# Altium schematic sheet 2_drivers_e_Motores.SchDoc: Teseu - Drivers
size A4; DocumentNumber: 2; Revision: 0.1; SheetNumber: 3; SheetTotal: 6
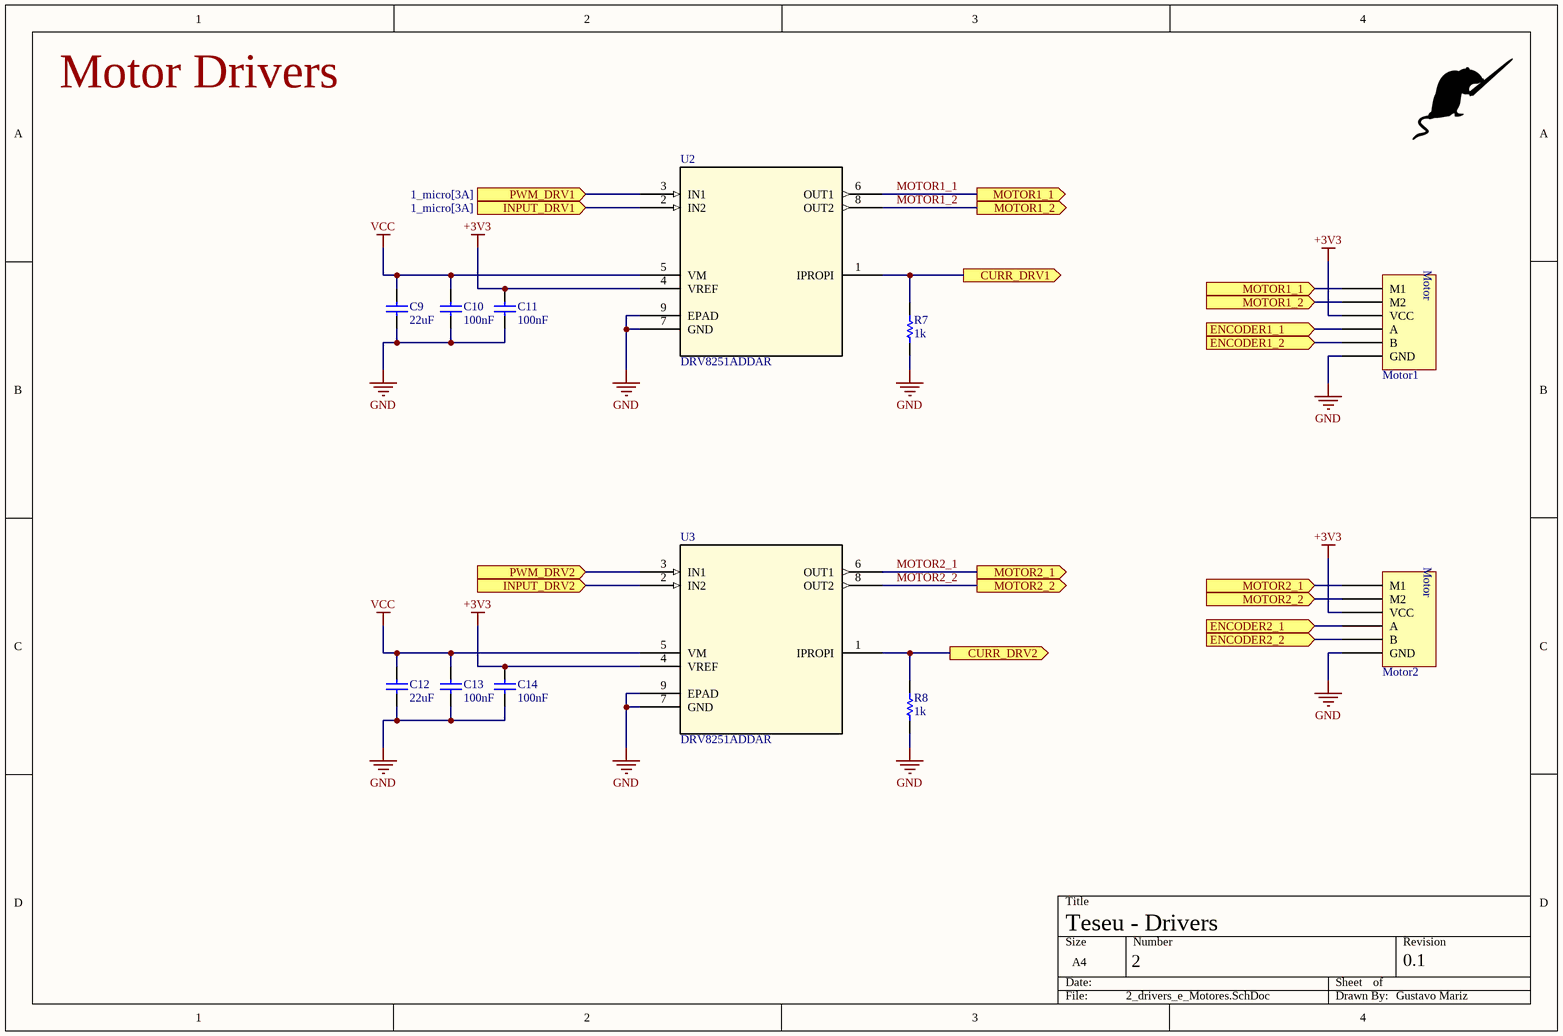
[diagram p0: 2_drivers_e_Motores.SchDoc]

## Parts
C9  Valor: 22uF  [CAP 0805]  (hidden comment: CAP)
C10  Valor: 100nF  [0603]  (hidden comment: CAP)
C11  Valor: 100nF  [0603]  (hidden comment: CAP)
C12  Valor: 22uF  [CAP 0805]  (hidden comment: CAP)
C13  Valor: 100nF  [0603]  (hidden comment: CAP)
C14  Valor: 100nF  [0603]  (hidden comment: CAP)
Motor1  Micro Motor c/ Encoder  [Micro Metal c/ Encoder]  (value not drawn)
Motor2  Micro Motor c/ Encoder  [Micro Metal c/ Encoder]  (value not drawn)
R7  value 1k  [RES 0603]  (hidden comment: RESISTOR)
R8  value 1k  [RES 0603]  (hidden comment: RESISTOR)
U2  DRV8251ADDAR  [SOIC8_DDA_TEX]
U3  DRV8251ADDAR  [SOIC8_DDA_TEX]

## Ports
CURR_DRV1 (out, see 1_micro[2B]), CURR_DRV2 (out, see 1_micro[3A]), ENCODER1_1 (in, see 1_micro[3A]), ENCODER1_2 (in, see 1_micro[2B]), ENCODER2_1 (in, see 1_micro[2A]), ENCODER2_2 (in, see 1_micro[2A]), INPUT_DRV1 (in, see 1_micro[3A]), INPUT_DRV2 (in, see 1_micro[2B]), MOTOR1_1 (in, see 2_drivers_e_Motores[3A]), MOTOR1_1 (out, see 2_drivers_e_Motores[4B]), MOTOR1_2 (in, see 2_drivers_e_Motores[3A]), MOTOR1_2 (out, see 2_drivers_e_Motores[4B]), MOTOR2_1 (in, see 2_drivers_e_Motores[3C]), MOTOR2_1 (out, see 2_drivers_e_Motores[4C]), MOTOR2_2 (in, see 2_drivers_e_Motores[3C]), MOTOR2_2 (out, see 2_drivers_e_Motores[4C]), PWM_DRV1 (in, see 1_micro[3A]), PWM_DRV2 (in, see 1_micro[2B])

## Nets
+3V3: C11.2 C14.2 Motor1.4(VCC) Motor2.4(VCC) U2.4(VREF) U3.4(VREF)
GND: C9.1 C10.1 C11.1 C12.1 C13.1 C14.1 Motor1.1(GND) Motor2.1(GND) R7.1 R8.1 U2.7(GND) U2.9(EPAD) U3.7(GND) U3.9(EPAD)
VCC: C9.2 C10.2 C12.2 C13.2 U2.5(VM) U3.5(VM)
CURR_DRV1: R7.2 U2.1(IPROPI) ; port CURR_DRV1
CURR_DRV2: R8.2 U3.1(IPROPI) ; port CURR_DRV2
ENCODER1_1: Motor1.3(A) ; port ENCODER1_1
ENCODER1_2: Motor1.2(B) ; port ENCODER1_2
ENCODER2_1: Motor2.3(A) ; port ENCODER2_1
ENCODER2_2: Motor2.2(B) ; port ENCODER2_2
INPUT_DRV1: U2.2(IN2) ; port INPUT_DRV1
INPUT_DRV2: U3.2(IN2) ; port INPUT_DRV2
MOTOR1_1: Motor1.6(M1) U2.6(OUT1) ; port MOTOR1_1
MOTOR1_2: Motor1.5(M2) U2.8(OUT2) ; port MOTOR1_2
MOTOR2_1: Motor2.6(M1) U3.6(OUT1) ; port MOTOR2_1
MOTOR2_2: Motor2.5(M2) U3.8(OUT2) ; port MOTOR2_2
PWM_DRV1: U2.3(IN1) ; port PWM_DRV1
PWM_DRV2: U3.3(IN1) ; port PWM_DRV2

## Notes on the sheet
- Motor Drivers
- Gustavo Mariz
- (in symbol Micro Motor c/ Encoder) Motor

## Library data of the parts
C9-C14 = CAP. CERÂMICO: Capacitor; Criador por: Luigi Eduardo; Pertence a: Trincabotz; Criado em: 26/06/2012
U2 U3 = DRV8251ADDAR: No Description Available; Mfr_Name: Texas Instruments; RefDes: RefDes; Type: Type